# EasyEDA Pro project keyboard_hewis.epro, schematic Cockpit_1
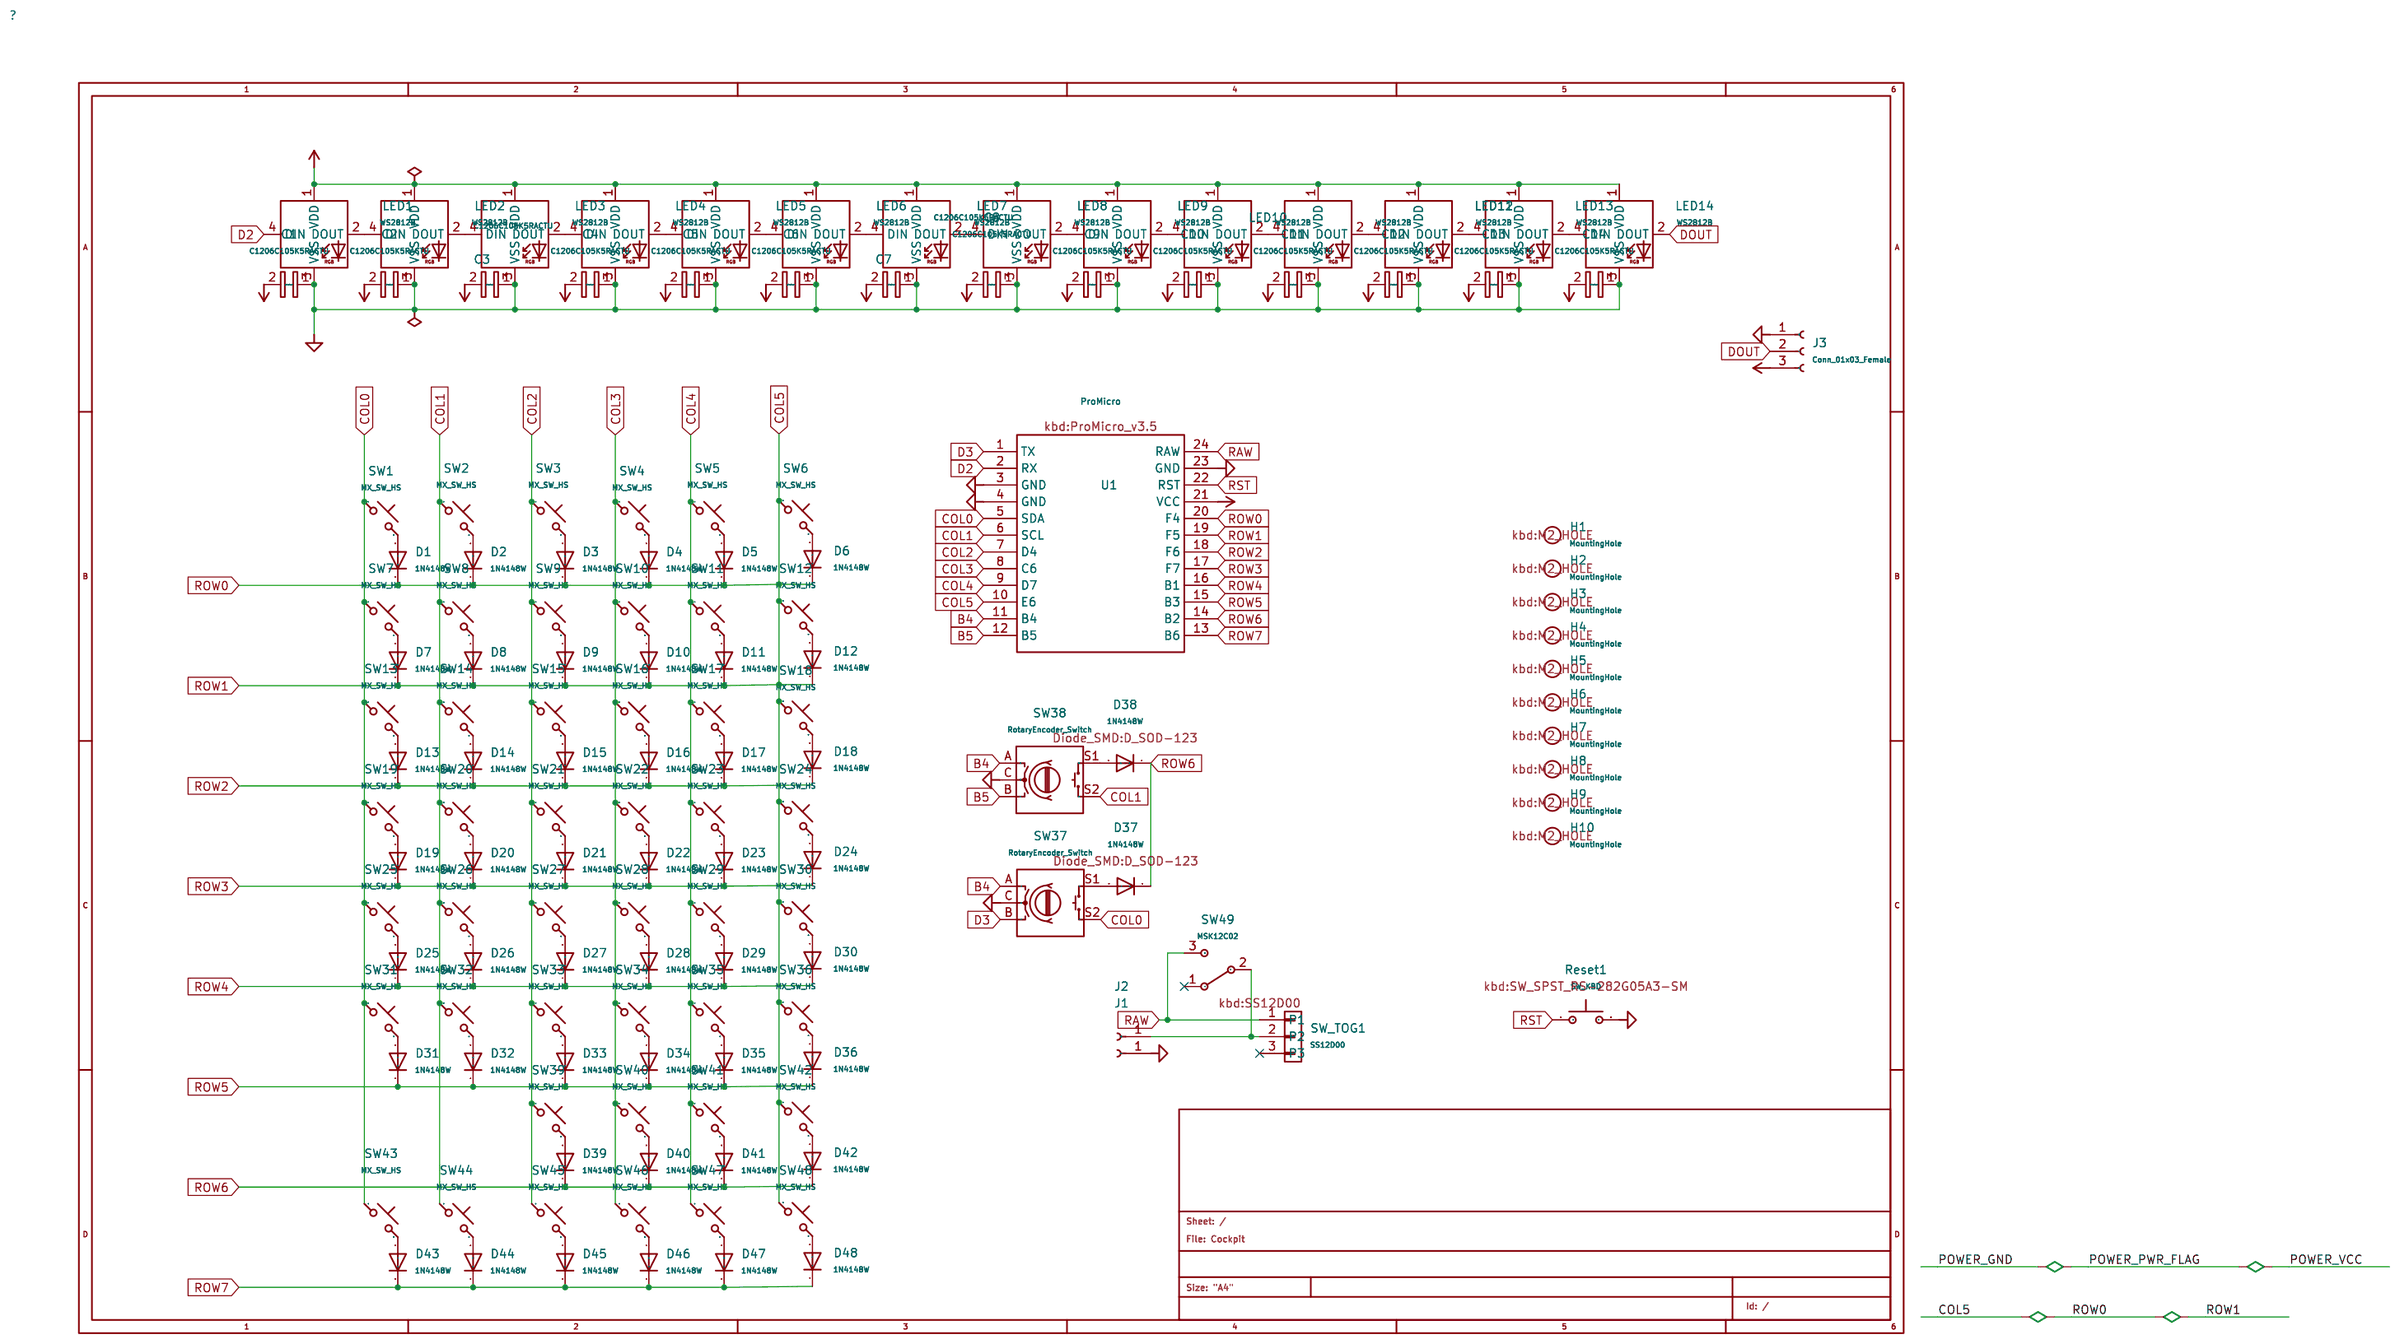
[diagram p0: schematic sheet]

## Parts
C1  C1206C105K5RACTU
C2  C1206C105K5RACTU
C3  C1206C105K5RACTU
C4  C1206C105K5RACTU
C5  C1206C105K5RACTU
C6  C1206C105K5RACTU
C7  C1206C105K5RACTU
C8  C1206C105K5RACTU
C9  C1206C105K5RACTU
C10  C1206C105K5RACTU
C11  C1206C105K5RACTU
C12  C1206C105K5RACTU
C13  C1206C105K5RACTU
C14  C1206C105K5RACTU
D1  1N4148W
D2  1N4148W
D3  1N4148W
D4  1N4148W
D5  1N4148W
D6  1N4148W
D7  1N4148W
D8  1N4148W
D9  1N4148W
D10  1N4148W
D11  1N4148W
D12  1N4148W
D13  1N4148W
D14  1N4148W
D15  1N4148W
D16  1N4148W
D17  1N4148W
D18  1N4148W
D19  1N4148W
D20  1N4148W
D21  1N4148W
D22  1N4148W
D23  1N4148W
D24  1N4148W
D25  1N4148W
D26  1N4148W
D27  1N4148W
D28  1N4148W
D29  1N4148W
D30  1N4148W
D31  1N4148W
D32  1N4148W
D33  1N4148W
D34  1N4148W
D35  1N4148W
D36  1N4148W
D37  1N4148W
D38  1N4148W
D39  1N4148W
D40  1N4148W
D41  1N4148W
D42  1N4148W
D43  1N4148W
D44  1N4148W
D45  1N4148W
D46  1N4148W
D47  1N4148W
D48  1N4148W
H1  MountingHole
H2  MountingHole
H3  MountingHole
H4  MountingHole
H5  MountingHole
H6  MountingHole
H7  MountingHole
H8  MountingHole
H9  MountingHole
H10  MountingHole
J1  Conn_01x01_Female
J2  Conn_01x01_Female
J3  Conn_01x03_Female
LED1  WS2812B
LED2  WS2812B
LED3  WS2812B
LED4  WS2812B
LED5  WS2812B
LED6  WS2812B
LED7  WS2812B
LED8  WS2812B
LED9  WS2812B
LED10  WS2812B
LED11  WS2812B
LED12  WS2812B
LED13  WS2812B
LED14  WS2812B
Reset1  SW_KBD
SW1  MX_SW_HS
SW2  MX_SW_HS
SW3  MX_SW_HS
SW4  MX_SW_HS
SW5  MX_SW_HS
SW6  MX_SW_HS
SW7  MX_SW_HS
SW8  MX_SW_HS
SW9  MX_SW_HS
SW10  MX_SW_HS
SW11  MX_SW_HS
SW12  MX_SW_HS
SW13  MX_SW_HS
SW14  MX_SW_HS
SW15  MX_SW_HS
SW16  MX_SW_HS
SW17  MX_SW_HS
SW18  MX_SW_HS
SW19  MX_SW_HS
SW20  MX_SW_HS
SW21  MX_SW_HS
SW22  MX_SW_HS
SW23  MX_SW_HS
SW24  MX_SW_HS
SW25  MX_SW_HS
SW26  MX_SW_HS
SW27  MX_SW_HS
SW28  MX_SW_HS
SW29  MX_SW_HS
SW30  MX_SW_HS
SW31  MX_SW_HS
SW32  MX_SW_HS
SW33  MX_SW_HS
SW34  MX_SW_HS
SW35  MX_SW_HS
SW36  MX_SW_HS
SW37  RotaryEncoder_Switch
SW38  RotaryEncoder_Switch
SW39  MX_SW_HS
SW40  MX_SW_HS
SW41  MX_SW_HS
SW42  MX_SW_HS
SW43  MX_SW_HS
SW44  MX_SW_HS
SW45  MX_SW_HS
SW46  MX_SW_HS
SW47  MX_SW_HS
SW48  MX_SW_HS
SW49  MSK12C02
SW_TOG1  SS12D00
U1  ProMicro

## Library data of the parts
C1-C14 = C1206C105K5RACTU_C1206C105K5RACTU
D1-D48 = Diode_1N4148W: User doc link: https://www.vishay.com/docs/85748/1n4148w.pdf
H1-H10 = Mechanical_MountingHole
J1 J2 = Connector_Conn_01x01_Female
J3 = Connector_Conn_01x03_Female
LED1-LED14 = LED_WS2812B: User doc link: https://cdn-shop.adafruit.com/datasheets/WS2812B.pdf
Reset1 = Switch_SW_KBD
SW1-SW36 SW39-SW48 = marbastlib-mx_MX_SW_HS
SW37 SW38 = Device_RotaryEncoder_Switch
SW49 = Switch_SW_SPDT
SW_TOG1 = Switch_SS12D00
U1 = ProMicro_ProMicro

## Nets
B4: SW37.A SW38.A U1.11(B4)
B5: SW38.B U1.12(B5)
COL0: SW1.1 SW7.1 SW13.1 SW19.1 SW25.1 SW31.1 SW37.S2 SW43.1 U1.5(SDA)
COL1: SW2.1 SW8.1 SW14.1 SW20.1 SW26.1 SW32.1 SW38.S2 SW44.1 U1.6(SCL)
COL2: SW3.1 SW9.1 SW15.1 SW21.1 SW27.1 SW33.1 SW39.1 SW45.1 U1.7(D4)
COL3: SW4.1 SW10.1 SW16.1 SW22.1 SW28.1 SW34.1 SW40.1 SW46.1 U1.8(C6)
COL4: SW5.1 SW11.1 SW17.1 SW23.1 SW29.1 SW35.1 SW41.1 SW47.1 U1.9(D7)
COL5: D1.1(K) D2.1(K) D3.1(K) D4.1(K) D5.1(K) D6.1(K) D7.1(K) D8.1(K) D9.1(K) D10.1(K) D11.1(K) D12.1(K) SW6.1 SW12.1 SW18.1 SW24.1 SW30.1 SW36.1 SW42.1 SW48.1 U1.10(E6) U1.19(F5) U1.20(F4)
D2: LED1.4(DIN) U1.2(RX)
D3: SW37.B U1.1(TX)
DOUT: J3.2(Pin) LED14.2(DOUT)
POWER_GND: C1.1 C1.2 C2.1 C2.2 C3.1 C3.2 C4.1 C4.2 C5.1 C5.2 C6.1 C6.2 C7.1 C7.2 C8.1 C8.2 C9.1 C9.2 C10.1 C10.2 C11.1 C11.2 C12.1 C12.2 C13.1 C13.2 C14.1 C14.2 J1.1(Pin) J3.1(Pin) J3.3(Pin) LED1.1(VDD) LED1.3(VSS) LED2.1(VDD) LED2.3(VSS) LED3.1(VDD) LED3.3(VSS) LED4.1(VDD) LED4.3(VSS) LED5.1(VDD) LED5.3(VSS) LED6.1(VDD) LED6.3(VSS) LED7.1(VDD) LED7.3(VSS) LED8.1(VDD) LED8.3(VSS) LED9.1(VDD) LED9.3(VSS) LED10.1(VDD) LED10.3(VSS) LED11.1(VDD) LED11.3(VSS) LED12.1(VDD) LED12.3(VSS) LED13.1(VDD) LED13.3(VSS) LED14.1(VDD) LED14.3(VSS) Reset1.2 SW37.C SW38.C U1.3(GND) U1.4(GND) U1.21(VCC) U1.23(GND)
RAW: SW49.3(C) SW_TOG1.1(P1) U1.24(RAW)
ROW2: D13.1(K) D14.1(K) D15.1(K) D16.1(K) D17.1(K) D18.1(K) U1.18(F6)
ROW3: D19.1(K) D20.1(K) D21.1(K) D22.1(K) D23.1(K) D24.1(K) U1.17(F7)
ROW4: D25.1(K) D26.1(K) D27.1(K) D28.1(K) D29.1(K) D30.1(K) U1.16(B1)
ROW5: D31.1(K) D32.1(K) D33.1(K) D34.1(K) D35.1(K) D36.1(K) U1.15(B3)
ROW6: D37.1(K) D38.1(K) D39.1(K) D40.1(K) D41.1(K) D42.1(K) U1.14(B2)
ROW7: D43.1(K) D44.1(K) D45.1(K) D46.1(K) D47.1(K) D48.1(K) U1.13(B6)
RST: Reset1.1 U1.22(RST)
Net-(D1-2): D1.2(A) SW1.2
Net-(D2-2): D2.2(A) SW2.2
Net-(D3-2): D3.2(A) SW3.2
Net-(D4-2): D4.2(A) SW4.2
Net-(D5-2): D5.2(A) SW5.2
Net-(D6-2): D6.2(A) SW6.2
Net-(D7-2): D7.2(A) SW7.2
Net-(D8-2): D8.2(A) SW8.2
Net-(D9-2): D9.2(A) SW9.2
Net-(D10-2): D10.2(A) SW10.2
Net-(D11-2): D11.2(A) SW11.2
Net-(D12-2): D12.2(A) SW12.2
Net-(D13-2): D13.2(A) SW13.2
Net-(D14-2): D14.2(A) SW14.2
Net-(D15-2): D15.2(A) SW15.2
Net-(D16-2): D16.2(A) SW16.2
Net-(D17-2): D17.2(A) SW17.2
Net-(D18-2): D18.2(A) SW18.2
Net-(D19-2): D19.2(A) SW19.2
Net-(D20-2): D20.2(A) SW20.2
Net-(D21-2): D21.2(A) SW21.2
Net-(D22-2): D22.2(A) SW22.2
Net-(D23-2): D23.2(A) SW23.2
Net-(D24-2): D24.2(A) SW24.2
Net-(D25-2): D25.2(A) SW25.2
Net-(D26-2): D26.2(A) SW26.2
Net-(D27-2): D27.2(A) SW27.2
Net-(D28-2): D28.2(A) SW28.2
Net-(D29-2): D29.2(A) SW29.2
Net-(D30-2): D30.2(A) SW30.2
Net-(D31-2): D31.2(A) SW31.2
Net-(D32-2): D32.2(A) SW32.2
Net-(D33-2): D33.2(A) SW33.2
Net-(D34-2): D34.2(A) SW34.2
Net-(D35-2): D35.2(A) SW35.2
Net-(D36-2): D36.2(A) SW36.2
Net-(D37-2): D37.2(A) SW37.S1
Net-(D38-2): D38.2(A) SW38.S1
Net-(D39-2): D39.2(A) SW39.2
Net-(D40-2): D40.2(A) SW40.2
Net-(D41-2): D41.2(A) SW41.2
Net-(D42-2): D42.2(A) SW42.2
Net-(D43-2): D43.2(A) SW43.2
Net-(D44-2): D44.2(A) SW44.2
Net-(D45-2): D45.2(A) SW45.2
Net-(D46-2): D46.2(A) SW46.2
Net-(D47-2): D47.2(A) SW47.2
Net-(D48-2): D48.2(A) SW48.2
Net-(J2-1): J2.1(Pin) SW49.2(B) SW_TOG1.2(P2)
Net-(LED1-2): LED1.2(DOUT) LED2.4(DIN)
Net-(LED2-2): LED2.2(DOUT) LED3.4(DIN)
Net-(LED3-2): LED3.2(DOUT) LED4.4(DIN)
Net-(LED4-2): LED4.2(DOUT) LED5.4(DIN)
Net-(LED5-2): LED5.2(DOUT) LED6.4(DIN)
Net-(LED6-2): LED6.2(DOUT) LED7.4(DIN)
Net-(LED7-2): LED7.2(DOUT) LED8.4(DIN)
Net-(LED8-2): LED8.2(DOUT) LED9.4(DIN)
Net-(LED9-2): LED9.2(DOUT) LED10.4(DIN)
Net-(LED10-2): LED10.2(DOUT) LED11.4(DIN)
Net-(LED11-2): LED11.2(DOUT) LED12.4(DIN)
Net-(LED12-2): LED12.2(DOUT) LED13.4(DIN)
Net-(LED13-2): LED13.2(DOUT) LED14.4(DIN)

Not connected (* = marked no-connect by the designer): SW49 1(A)*; SW_TOG1 3(P3)*
